# Altium schematic sheet TE0719.SchDoc: ZoM Mod A - Connectors
size A4; Organization: Trenz Electronic GmbH / TT; DocumentNumber: 2; Revision: 01; SheetNumber: 2; SheetTotal: 13; Date: 12/16/2014
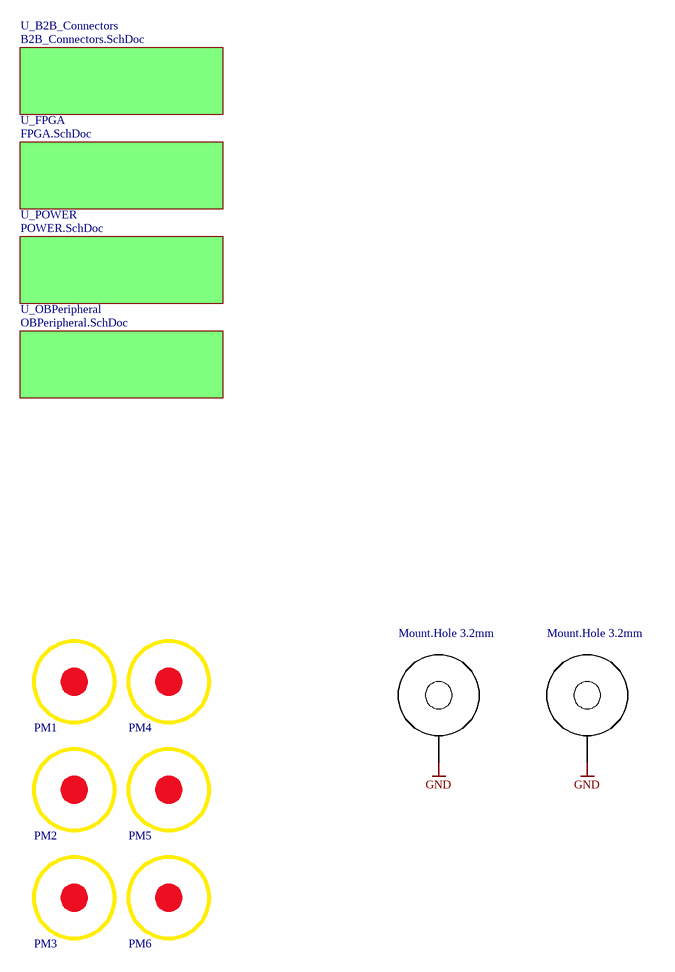
[diagram p0: TE0719.SchDoc]

## Parts
H1  Mount.Hole 3.2mm  [MHole3_2mm]  (no BOM)
H4  Mount.Hole 3.2mm  [MHole3_2mm]  (no BOM)
PM1  FIDU-DOT - small  [FIDU-DOT - small]  (value not drawn)
PM2  FIDU-DOT - small  [FIDU-DOT - small]  (value not drawn)
PM3  FIDU-DOT - small  [FIDU-DOT - small]  (value not drawn)
PM4  FIDU-DOT - small  [FIDU-DOT - small]  (value not drawn)
PM5  FIDU-DOT - small  [FIDU-DOT - small]  (value not drawn)
PM6  FIDU-DOT - small  [FIDU-DOT - small]  (value not drawn)

## Sub-sheets
U_B2B_Connectors = B2B_Connectors.SchDoc: no entries
U_FPGA = FPGA.SchDoc: no entries
U_OBPeripheral = OBPeripheral.SchDoc: no entries
U_POWER = POWER.SchDoc: no entries

## Nets
GND: H1.1 H4.1

## Notes on the sheet
- Title:
- Nummer:
- Rev.
- Datum:
- A4
- Zeichner:
- Blatt
- von
- Filename:

## Library data of the parts
H1 H4 = 22898: AN: 22898; Mixed: THT
PM1-PM6 = 22905: AN: 22905; Mixed: FIDU